# Altium schematic sheet Memory.SchDoc
size A; SheetNumber: 4; SheetTotal: 5
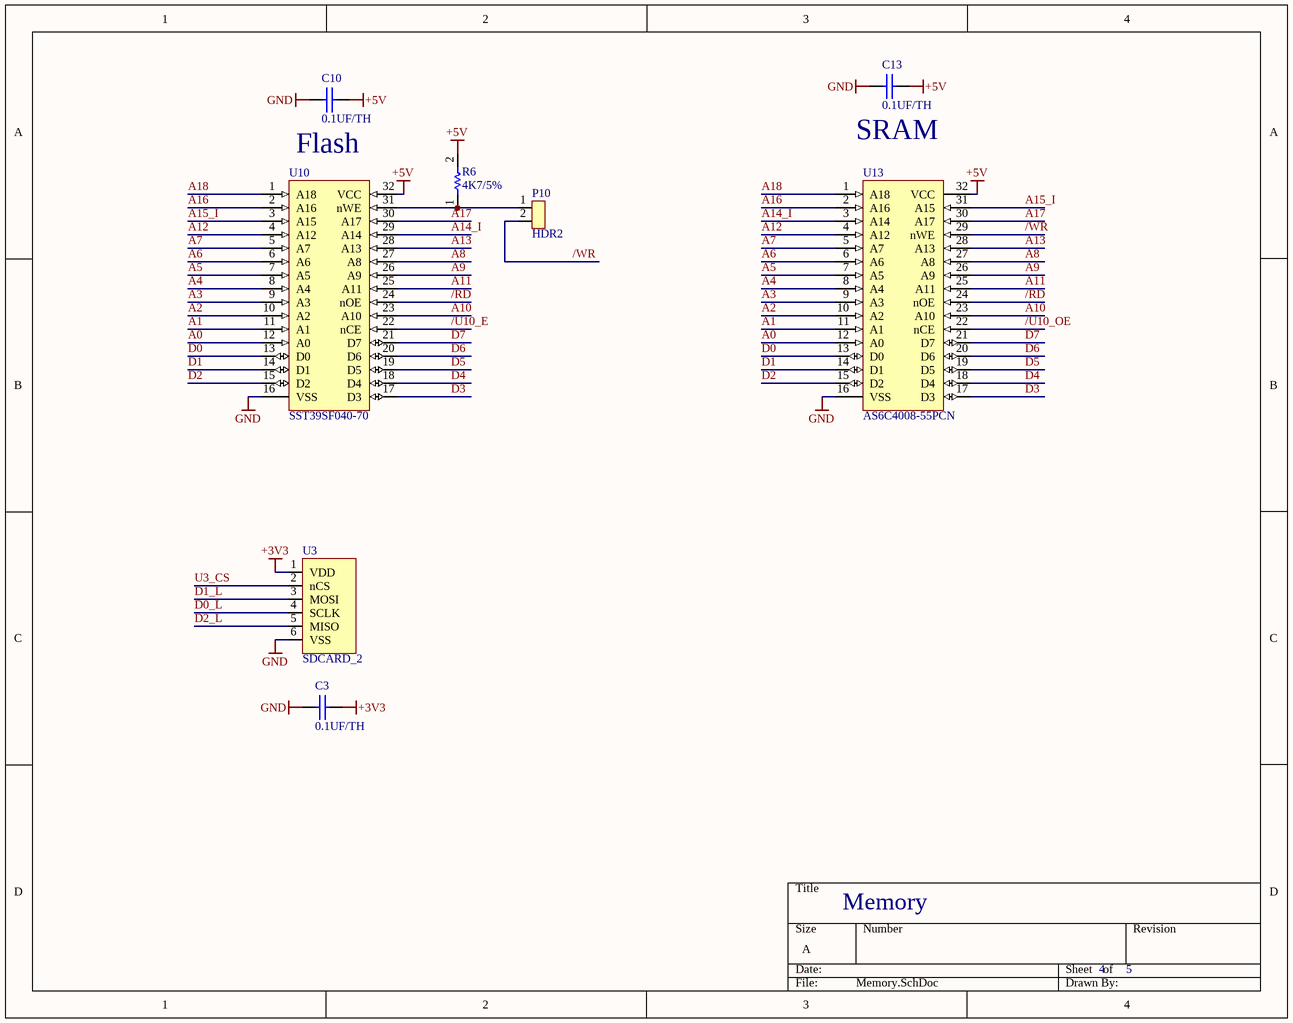
[diagram p0: Memory.SchDoc]

## Parts
C3  0.1UF/TH  [CAPH5]
C10  0.1UF/TH  [CAPH5]
C13  0.1UF/TH  [CAPH5]
P10  HDR2  [HDR2]
R6  4K7/5%  [CF18]
U3  SDCARD_2  [SDMODULE1_FLIPPED]
U10  SST39SF040-70  [DIP32]
U13  AS6C4008-55PCN  [DIP32]

## Nets
+3V3: C3.2 U3.1(VDD)
+5V: C10.2 C13.2 R6.2 U10.32(VCC) U13.32(VCC)
GND: C3.1 C10.1 C13.1 U3.6(VSS) U10.16(VSS) U13.16(VSS)
/RD: U10.24(nOE) U13.24(nOE)
/U10_E: U10.22(nCE)
/U10_OE: U13.22(nCE)
/WR: P10.2 U13.29(nWE)
A0: U10.12(A0) U13.12(A0)
A1: U10.11(A1) U13.11(A1)
A2: U10.10(A2) U13.10(A2)
A3: U10.9(A3) U13.9(A3)
A4: U10.8(A4) U13.8(A4)
A5: U10.7(A5) U13.7(A5)
A6: U10.6(A6) U13.6(A6)
A7: U10.5(A7) U13.5(A7)
A8: U10.27(A8) U13.27(A8)
A9: U10.26(A9) U13.26(A9)
A10: U10.23(A10) U13.23(A10)
A11: U10.25(A11) U13.25(A11)
A12: U10.4(A12) U13.4(A12)
A13: U10.28(A13) U13.28(A13)
A14_I: U10.29(A14) U13.3(A14)
A15_I: U10.3(A15) U13.31(A15)
A16: U10.2(A16) U13.2(A16)
A17: U10.30(A17) U13.30(A17)
A18: U10.1(A18) U13.1(A18)
D0: U10.13(D0) U13.13(D0)
D0_L: U3.4(SCLK)
D1: U10.14(D1) U13.14(D1)
D1_L: U3.3(MOSI)
D2: U10.15(D2) U13.15(D2)
D2_L: U3.5(MISO)
D3: U10.17(D3) U13.17(D3)
D4: U10.18(D4) U13.18(D4)
D5: U10.19(D5) U13.19(D5)
D6: U10.20(D6) U13.20(D6)
D7: U10.21(D7) U13.21(D7)
U3_CS: U3.2(nCS)
NetP10_1: P10.1 R6.1 U10.31(nWE)

## Notes on the sheet
- Flash
- (near C13) SRAM
- Memory

## Library data of the parts
C3 C10 C13 = 0.1UF/TH: 0.1 µF ±10% 50V Ceramic Capacitor X7R Radial; MFG: Vishay; MFG PN: K104K10X7RF5UH5; DK PN: BC2665CT-ND; Price: 1.17
R6 = 4K7/5%: RES 4.7K OHM 5% 1/8W AXIAL; MFG PN: CF18JT4K70; DK PN: CF18JT4K70CT-ND; MFG: Stackpole; Populate: *
U3 = SDCARD_2: Micro SD card module; MFG: TE; MFG PN: 2041021-4; DK PN: A101492CT-ND; Price: 3.69; URL: https://www.amazon.com/dp/B0989SM146?psc=1&ref=ppx_yo2ov_dt_b_product_details
U10 = SST39SF040-70: FLASH Memory IC 4Mbit Parallel 70 ns 32-PDIP; MFG: Microchip; MFG PN: SST39SF040-70-4C-PHE; DK PN: SST39SF040-70-4C-PHE-ND; Price: 1.17
U13 = AS6C4008-55PCN: SRAM - Asynchronous Memory IC 4Mb (512K x 8) Parallel 55 ns 32-DIP; MFG: Alliance Memory, Inc.; DK PN: 1450-1027-ND; MFG PN: AS6C4008-55PCN; Price: 1.17